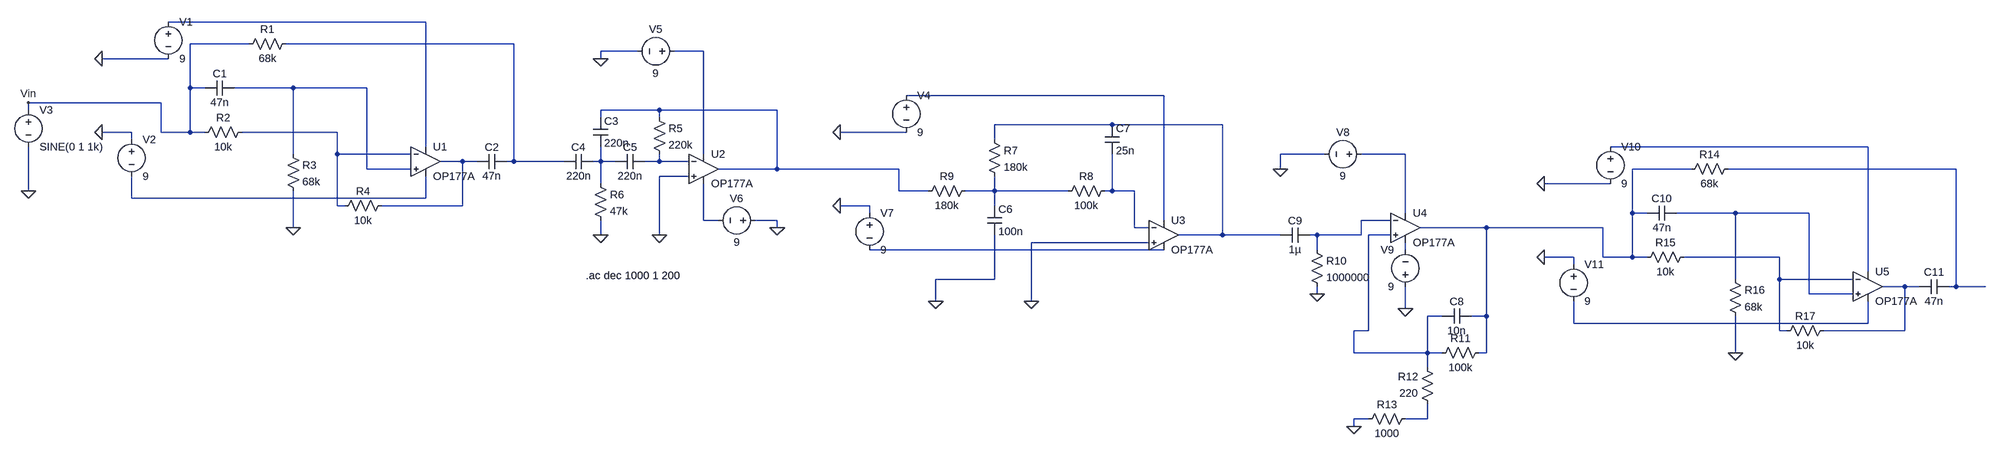
[diagram p0: schematic Circuit Version 0.0.asc]
Circuit Version 0.0.asc, the LTspice schematic file:
Version 4
SHEET 1 5020 1000
WIRE 576 96 16 96
WIRE 192 144 64 144
WIRE 768 144 272 144
WIRE 1360 160 1280 160
WIRE 1504 160 1440 160
WIRE 16 176 -128 176
WIRE 1280 176 1280 160
WIRE 64 240 64 144
WIRE 96 240 64 240
WIRE 288 240 160 240
WIRE 448 240 288 240
WIRE 2720 256 2160 256
WIRE 0 272 -288 272
WIRE -288 288 -288 272
WIRE 1408 288 1280 288
WIRE 1664 288 1408 288
WIRE 1280 304 1280 288
WIRE 1408 304 1408 288
WIRE 2608 320 2352 320
WIRE 2848 320 2608 320
WIRE -64 336 -128 336
WIRE 0 336 0 272
WIRE 64 336 64 240
WIRE 64 336 0 336
WIRE 96 336 64 336
WIRE 384 336 176 336
WIRE 2160 336 2016 336
WIRE -64 352 -64 336
WIRE 2352 352 2352 320
WIRE 576 368 576 96
WIRE 4640 368 4080 368
WIRE 288 384 288 240
WIRE 384 384 384 336
WIRE 544 384 384 384
WIRE 1504 384 1504 160
WIRE 3248 384 3152 384
WIRE 3424 384 3328 384
WIRE 656 400 608 400
WIRE 688 400 656 400
WIRE 768 400 768 144
WIRE 768 400 752 400
WIRE 1200 400 768 400
WIRE 1280 400 1280 368
WIRE 1280 400 1264 400
WIRE 1312 400 1280 400
WIRE 1408 400 1408 384
WIRE 1408 400 1376 400
WIRE 1472 400 1408 400
WIRE 448 416 448 240
WIRE 544 416 448 416
WIRE 1664 416 1664 288
WIRE 1664 416 1536 416
WIRE 2144 416 1664 416
WIRE 3152 416 3152 384
WIRE 4256 416 4128 416
WIRE 4832 416 4336 416
WIRE 1472 432 1408 432
WIRE 1280 448 1280 400
WIRE 4080 448 3936 448
WIRE -288 464 -288 368
WIRE 2144 464 2144 416
WIRE 2208 464 2144 464
WIRE 2352 464 2352 432
WIRE 2352 464 2288 464
WIRE 2512 464 2352 464
WIRE 2608 464 2608 384
WIRE 2608 464 2592 464
WIRE 2656 464 2608 464
WIRE -64 480 -64 432
WIRE 576 480 576 432
WIRE 576 480 -64 480
WIRE 384 496 384 384
WIRE 400 496 384 496
WIRE 656 496 656 400
WIRE 656 496 480 496
WIRE 2080 496 2016 496
WIRE 2352 496 2352 464
WIRE 2080 512 2080 496
WIRE 3424 512 3424 384
WIRE 4128 512 4128 416
WIRE 4160 512 4128 512
WIRE 4352 512 4224 512
WIRE 4512 512 4352 512
WIRE 1504 528 1504 448
WIRE 1536 528 1504 528
WIRE 1664 528 1616 528
WIRE 2720 528 2720 256
WIRE 3392 528 3328 528
WIRE 288 544 288 464
WIRE 1664 544 1664 528
WIRE 2656 544 2656 464
WIRE 2688 544 2656 544
WIRE 3600 544 3456 544
WIRE 4064 544 3600 544
WIRE 1280 560 1280 528
WIRE 1408 560 1408 432
WIRE 2848 560 2848 320
WIRE 2848 560 2752 560
WIRE 3152 560 2848 560
WIRE 3232 560 3216 560
WIRE 3328 560 3328 528
WIRE 3328 560 3232 560
WIRE 3392 560 3344 560
WIRE 2688 576 2432 576
WIRE 2720 592 2080 592
WIRE 3232 592 3232 560
WIRE 3424 592 3424 576
WIRE 4000 608 3936 608
WIRE 4064 608 4064 544
WIRE 4128 608 4128 512
WIRE 4128 608 4064 608
WIRE 4160 608 4128 608
WIRE 4448 608 4240 608
WIRE 4000 624 4000 608
WIRE 4640 640 4640 368
WIRE 2352 656 2352 560
WIRE 2352 656 2224 656
WIRE 4352 656 4352 512
WIRE 4448 656 4448 608
WIRE 4608 656 4448 656
WIRE 4720 672 4672 672
WIRE 4752 672 4720 672
WIRE 4832 672 4832 416
WIRE 4832 672 4816 672
WIRE 4896 672 4832 672
WIRE 3232 688 3232 672
WIRE 4512 688 4512 512
WIRE 4608 688 4512 688
WIRE 2224 704 2224 656
WIRE 2432 704 2432 576
WIRE 3424 720 3424 672
WIRE 3504 736 3472 736
WIRE 3600 736 3600 544
WIRE 3600 736 3568 736
WIRE 4000 752 4000 704
WIRE 4640 752 4640 704
WIRE 4640 752 4000 752
WIRE 3344 768 3344 560
WIRE 3344 768 3312 768
WIRE 4448 768 4448 656
WIRE 4464 768 4448 768
WIRE 4720 768 4720 672
WIRE 4720 768 4544 768
WIRE 3312 816 3312 768
WIRE 3472 816 3472 736
WIRE 3472 816 3312 816
WIRE 3504 816 3472 816
WIRE 3600 816 3600 736
WIRE 3600 816 3584 816
WIRE 4352 816 4352 736
WIRE 3472 848 3472 816
WIRE 3344 960 3312 960
WIRE 3472 960 3472 928
WIRE 3472 960 3424 960
WIRE 3312 976 3312 960
FLAG 288 544 0
FLAG -128 336 0
FLAG -128 176 0
FLAG -288 464 0
FLAG -288 272 Vin
FLAG 1280 560 0
FLAG 1408 560 0
FLAG 1664 544 0
FLAG 1280 176 0
FLAG 2432 704 0
FLAG 2224 704 0
FLAG 2016 496 0
FLAG 2016 336 0
FLAG 3312 976 0
FLAG 3152 416 0
FLAG 3424 720 0
FLAG 3232 688 0
FLAG 4352 816 0
FLAG 3936 608 0
FLAG 3936 448 0
SYMBOL OpAmps/OP177A 576 336 R0
SYMATTR InstName U1
SYMBOL voltage 16 80 R0
SYMATTR InstName V1
SYMATTR Value 9
SYMBOL voltage -64 336 R0
SYMATTR InstName V2
SYMATTR Value 9
SYMBOL voltage -288 272 R0
SYMATTR InstName V3
SYMATTR Value SINE(0 1 1k)
SYMATTR Value2 AC 1
SYMBOL Res 288 128 R90
WINDOW 0 0 56 VBottom 2
WINDOW 3 32 56 VTop 2
SYMATTR InstName R1
SYMATTR Value 68k
SYMBOL Res 192 320 R90
WINDOW 0 0 56 VBottom 2
WINDOW 3 32 56 VTop 2
SYMATTR InstName R2
SYMATTR Value 10k
SYMBOL Res 272 368 R0
SYMATTR InstName R3
SYMATTR Value 68k
SYMBOL Res 496 480 R90
WINDOW 0 0 56 VBottom 2
WINDOW 3 32 56 VTop 2
SYMATTR InstName R4
SYMATTR Value 10k
SYMBOL Cap 160 224 R90
WINDOW 0 0 32 VBottom 2
WINDOW 3 32 32 VTop 2
SYMATTR InstName C1
SYMATTR Value 47n
SYMBOL Cap 752 384 R90
WINDOW 0 0 32 VBottom 2
WINDOW 3 32 32 VTop 2
SYMATTR InstName C2
SYMATTR Value 47n
SYMBOL OpAmps/OP177A 1504 352 R0
SYMATTR InstName U2
SYMBOL Res 1392 288 R0
SYMATTR InstName R5
SYMATTR Value 220k
SYMBOL Res 1264 432 R0
SYMATTR InstName R6
SYMATTR Value 47k
SYMBOL Cap 1264 304 R0
SYMATTR InstName C3
SYMATTR Value 220n
SYMBOL Cap 1264 384 R90
WINDOW 0 0 32 VBottom 2
WINDOW 3 32 32 VTop 2
SYMATTR InstName C4
SYMATTR Value 220n
SYMBOL Cap 1376 384 R90
WINDOW 0 0 32 VBottom 2
WINDOW 3 32 32 VTop 2
SYMATTR InstName C5
SYMATTR Value 220n
SYMBOL Voltage 1456 160 R90
WINDOW 0 -32 56 VBottom 2
WINDOW 3 32 56 VTop 2
SYMATTR InstName V5
SYMATTR Value 9
SYMBOL Voltage 1632 528 R90
WINDOW 0 -32 56 VBottom 2
WINDOW 3 32 56 VTop 2
SYMATTR InstName V6
SYMATTR Value 9
SYMBOL OpAmps/OP177A 2720 496 R0
SYMATTR InstName U3
SYMBOL voltage 2160 240 R0
SYMATTR InstName V4
SYMATTR Value 9
SYMBOL voltage 2080 496 R0
SYMATTR InstName V7
SYMATTR Value 9
SYMBOL Res 2336 336 R0
SYMATTR InstName R7
SYMATTR Value 180k
SYMBOL Res 2608 448 R90
WINDOW 0 0 56 VBottom 2
WINDOW 3 32 56 VTop 2
SYMATTR InstName R8
SYMATTR Value 100k
SYMBOL Res 2304 448 R90
WINDOW 0 0 56 VBottom 2
WINDOW 3 32 56 VTop 2
SYMATTR InstName R9
SYMATTR Value 180k
SYMBOL cap 2336 496 R0
SYMATTR InstName C6
SYMATTR Value 100n
SYMBOL cap 2592 320 R0
SYMATTR InstName C7
SYMATTR Value 25n
SYMBOL OpAmps/OP177A 3424 480 R0
SYMATTR InstName U4
SYMBOL Voltage 3344 384 R90
WINDOW 0 -32 56 VBottom 2
WINDOW 3 32 56 VTop 2
SYMATTR InstName V8
SYMATTR Value 9
SYMBOL Voltage 3424 688 R180
WINDOW 0 24 96 Left 2
WINDOW 3 24 16 Left 2
SYMATTR InstName V9
SYMATTR Value 9
SYMBOL Res 3216 576 R0
SYMATTR InstName R10
SYMATTR Value 1000000
SYMBOL Res 3600 800 R90
WINDOW 0 0 56 VBottom 2
WINDOW 3 32 56 VTop 2
SYMATTR InstName R11
SYMATTR Value 100k
SYMBOL Res 3488 944 R180
WINDOW 0 36 76 Left 2
WINDOW 3 36 40 Left 2
SYMATTR InstName R12
SYMATTR Value 220
SYMBOL Res 3328 976 R270
WINDOW 0 32 56 VTop 2
WINDOW 3 0 56 VBottom 2
SYMATTR InstName R13
SYMATTR Value 1000
SYMBOL Cap 3568 720 R90
WINDOW 0 0 32 VBottom 2
WINDOW 3 32 32 VTop 2
SYMATTR InstName C8
SYMATTR Value 10n
SYMBOL Cap 3216 544 R90
WINDOW 0 0 32 VBottom 2
WINDOW 3 32 32 VTop 2
SYMATTR InstName C9
SYMATTR Value 1µ
SYMBOL OpAmps/OP177A 4640 608 R0
SYMATTR InstName U5
SYMBOL voltage 4080 352 R0
SYMATTR InstName V10
SYMATTR Value 9
SYMBOL voltage 4000 608 R0
SYMATTR InstName V11
SYMATTR Value 9
SYMBOL Res 4352 400 R90
WINDOW 0 0 56 VBottom 2
WINDOW 3 32 56 VTop 2
SYMATTR InstName R14
SYMATTR Value 68k
SYMBOL Res 4256 592 R90
WINDOW 0 0 56 VBottom 2
WINDOW 3 32 56 VTop 2
SYMATTR InstName R15
SYMATTR Value 10k
SYMBOL Res 4336 640 R0
SYMATTR InstName R16
SYMATTR Value 68k
SYMBOL Res 4560 752 R90
WINDOW 0 0 56 VBottom 2
WINDOW 3 32 56 VTop 2
SYMATTR InstName R17
SYMATTR Value 10k
SYMBOL Cap 4224 496 R90
WINDOW 0 0 32 VBottom 2
WINDOW 3 32 32 VTop 2
SYMATTR InstName C10
SYMATTR Value 47n
SYMBOL Cap 4816 656 R90
WINDOW 0 0 32 VBottom 2
WINDOW 3 32 32 VTop 2
SYMATTR InstName C11
SYMATTR Value 47n
TEXT 1248 648 Left 2 !.ac dec 1000 1 200

The netlist it stands for:
* Circuit Version 0.0.asc
XU1 N004 N008 N001 N018 N011 OP177A  ; pins In+ In- V+ V- OUT
V1 N001 0 9
V2 0 N018 9
V3 Vin 0 SINE(0 1 1k) AC 1
R1 N002 Vin 68k
R2 N008 Vin 10k
R3 N004 0 68k
R4 N011 N008 10k
C1 N004 Vin 47n
C2 N002 N011 47n
XU2 0 N013 N003 N020 N006 OP177A  ; pins In+ In- V+ V- OUT
R5 N006 N013 220k
R6 N012 0 47k
C3 N006 N012 220n
C4 N012 N002 220n
C5 N013 N012 220n
V5 N003 0 9
V6 0 N020 9
XU3 0 N017 N005 N023 N007 OP177A  ; pins In+ In- V+ V- OUT
V4 N005 0 9
V7 0 N023 9
R7 N007 N016 180k
R8 N017 N016 100k
R9 N016 N006 180k
C6 N016 0 100n
C7 N007 N017 25n
XU4 N022 N021 N010 N024 N014 OP177A  ; pins In+ In- V+ V- OUT
V8 N010 0 9
V9 0 N024 9
R10 N021 0 1000000
R11 N014 N022 100k
R12 N028 N022 220
R13 0 N028 1000
C8 N014 N022 10n
C9 N021 N007 1µ
XU5 N019 N025 N009 N027 N026 OP177A  ; pins In+ In- V+ V- OUT
V10 N009 0 9
V11 0 N027 9
R14 N015 N014 68k
R15 N025 N014 10k
R16 N019 0 68k
R17 N026 N025 10k
C10 N019 N014 47n
C11 N015 N026 47n
.ac dec 1000 1 200
.backanno
.end